# EAGLE design ham_ii_digital_interface (EAGLE 8.1.1)

## Sheet 1 of 4: Pin Headers
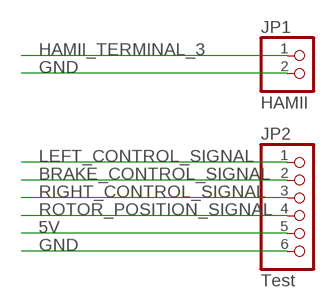
[diagram p0: schematic, sheet 1]

### Parts
JP1  HAMII  PINHD-1X2  [1X02]
JP2  Test  PINHD-1X6  [1X06]

### Nets
5V: JP2.5 ; also sheet 2,3,4
BRAKE_CONTROL_SIGNAL: JP2.2 ; also sheet 2,3
GND: JP1.2 JP2.6 ; also sheet 2,3,4
HAMII_TERMINAL_3: JP1.1 ; also sheet 4
LEFT_CONTROL_SIGNAL: JP2.1 ; also sheet 2,3
RIGHT_CONTROL_SIGNAL: JP2.3 ; also sheet 2,3
ROTOR_POSITION_SIGNAL: JP2.4 ; also sheet 2,4

## Sheet 2 of 4: Aruino Nano Interface
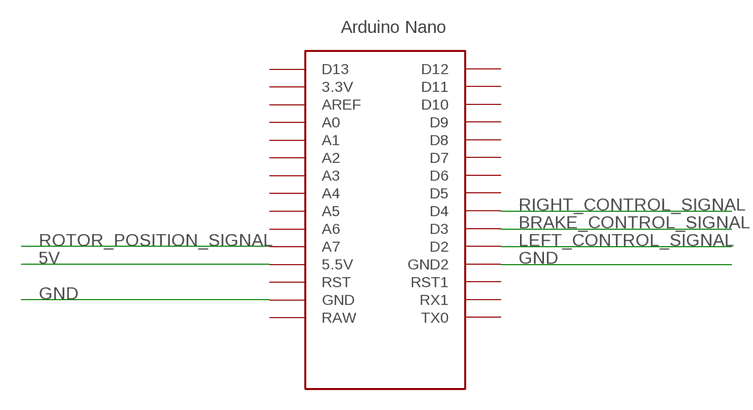
[diagram p1: schematic, sheet 2]

### Parts
U$1  NANO  [NANO]

### Nets
5V: U$1.5V(5.5V) ; also sheet 1,3,4
BRAKE_CONTROL_SIGNAL: U$1.D3 ; also sheet 1,3
GND: U$1.GND U$1.GND1(GND2) ; also sheet 1,3,4
LEFT_CONTROL_SIGNAL: U$1.D2 ; also sheet 1,3
RIGHT_CONTROL_SIGNAL: U$1.D4 ; also sheet 1,3
ROTOR_POSITION_SIGNAL: U$1.A7 ; also sheet 1,4
Unconnected: U$1.3.3V U$1.A0 U$1.A1 U$1.A2 U$1.A3 U$1.A4 U$1.A5 U$1.A6 U$1.AREF U$1.D5 U$1.D6 U$1.D7 U$1.D8 U$1.D9 U$1.D10 U$1.D11 U$1.D12 U$1.D13 U$1.ICSP1 U$1.ICSP2 U$1.ICSP3 U$1.ICSP4 U$1.ICSP5 U$1.ICSP6 U$1.RAW U$1.RST U$1.RST1 U$1.RX1 U$1.TX0

## Sheet 3 of 4: Relays
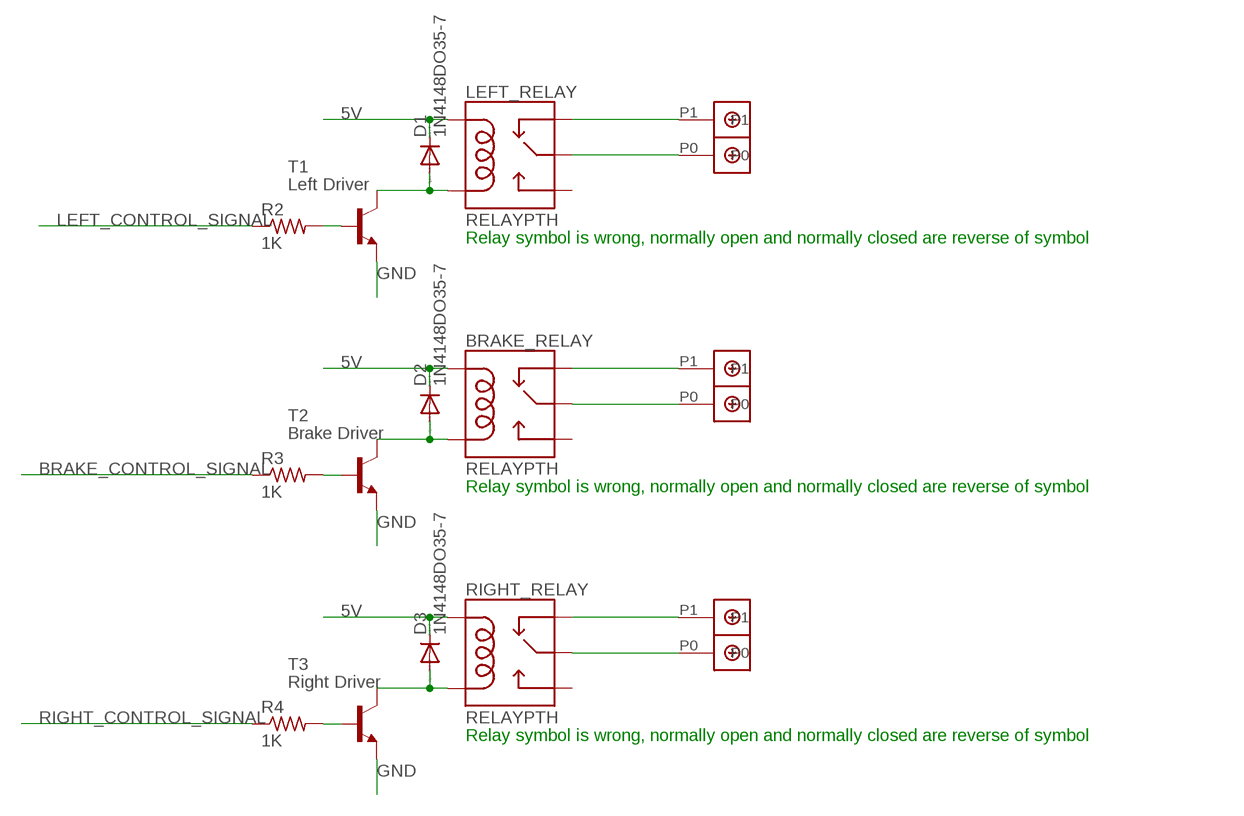
[diagram p2: schematic, sheet 3]

### Parts
BRAKE_RELAY  RELAYPTH  [SRD-05VDC-SL-C]
D1  1N4148DO35-7  [DO35-7]
D2  1N4148DO35-7  [DO35-7]
D3  1N4148DO35-7  [DO35-7]
LEFT_RELAY  RELAYPTH  [SRD-05VDC-SL-C]
R2  1K  R-US_0207/10  [0207/10]
R3  1K  R-US_0207/10  [0207/10]
R4  1K  R-US_0207/10  [0207/10]
RIGHT_RELAY  RELAYPTH  [SRD-05VDC-SL-C]
T1  Left Driver  -NPN-TO92  [TO92]
T2  Brake Driver  -NPN-TO92  [TO92]
T3  Right Driver  -NPN-TO92  [TO92]
U$5  DBCONN-1X2  [DBCONN-1X2]
U$6  DBCONN-1X2  [DBCONN-1X2]
U$7  DBCONN-1X2  [DBCONN-1X2]

### Nets
5V: BRAKE_RELAY.COIL1 D1.C D2.C D3.C LEFT_RELAY.COIL1 RIGHT_RELAY.COIL1 ; also sheet 1,2,4
BRAKE_CONTROL_SIGNAL: R3.1 ; also sheet 1,2
GND: T1.1(E) T2.1(E) T3.1(E) ; also sheet 1,2,4
LEFT_CONTROL_SIGNAL: R2.1 ; also sheet 1,2
N$2: LEFT_RELAY.SWCOMMON U$5.P0
N$3: LEFT_RELAY.SWCLOSED(SWCLOSE) U$5.P1
N$4: BRAKE_RELAY.SWCOMMON U$6.P0
N$5: BRAKE_RELAY.SWCLOSED(SWCLOSE) U$6.P1
N$6: RIGHT_RELAY.SWCOMMON U$7.P0
N$7: RIGHT_RELAY.SWCLOSED(SWCLOSE) U$7.P1
N$8: R2.2 T1.2(B)
N$9: R3.2 T2.2(B)
N$10: R4.2 T3.2(B)
N$11: D3.A RIGHT_RELAY.COIL0 T3.3(C)
N$12: BRAKE_RELAY.COIL0 D2.A T2.3(C)
N$13: D1.A LEFT_RELAY.COIL0 T1.3(C)
RIGHT_CONTROL_SIGNAL: R4.1 ; also sheet 1,2
Unconnected: BRAKE_RELAY.SWOPEN LEFT_RELAY.SWOPEN RIGHT_RELAY.SWOPEN

### Notes on the sheet
- Relay symbol is wrong, normally open and normally closed are reverse of symbol
- Relay symbol is wrong, normally open and normally closed are reverse of symbol
- Relay symbol is wrong, normally open and normally closed are reverse of symbol

## Sheet 4 of 4: Position Signal Buffer
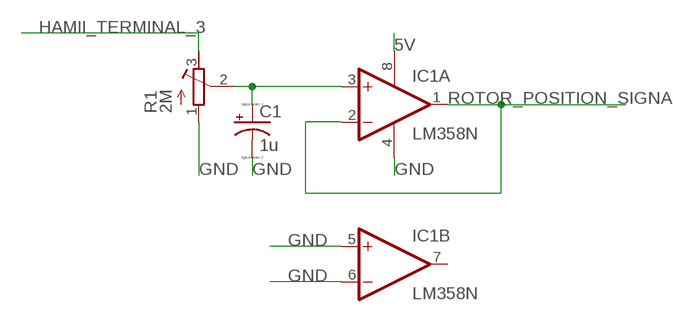
[diagram p3: schematic, sheet 4]

### Parts
C1  1u  CPOL-USE2-5  [E2-5]
IC1  LM358N  [DIL08]
R1  2M  R-TRIMM3296W  [RTRIM3296W]

### Nets
5V: IC1.8(P:V+) ; also sheet 1,2,3
GND: C1.- IC1.4(P:V-) IC1.5(B:+IN) IC1.6(B:-IN) R1.1(A) ; also sheet 1,2,3
HAMII_TERMINAL_3: R1.3(E) ; also sheet 1
N$1: C1.+ IC1.3(A:+IN) R1.2(S)
ROTOR_POSITION_SIGNAL: IC1.1(A:OUT) IC1.2(A:-IN) ; also sheet 1,2
Unconnected: IC1.7(B:OUT)

## Library data of the parts
BRAKE_RELAY LEFT_RELAY RIGHT_RELAY = SRD-05VDC-SL-C:RELAY: SPDT relay (COM-00101)
C1 = resistor:CPOL-US: POLARIZED CAPACITOR, American symbol
D1-D3 = diode:1N4148: DIODE high speed (Philips)
IC1 = linear:LM358: OP AMP also LM158; LM258; LM2904 Source: http://cache.national.com/ds/LM/LM158.pdf
JP1 = pinhead:PINHD-1X2: PIN HEADER
JP2 = pinhead:PINHD-1X6: PIN HEADER
R1 = resistor:R-TRIMM: Trimm resistor
R2-R4 = resistor:R-US_: RESISTOR, American symbol
T1-T3 = transistor:*-NPN-: NPN Transistror BF959 corrected 2008.03.06
U$1 = Arduino-clone:NANO: Arduino Nano
U$5-U$7 = Terminal Block Connector:DBCONN-1X2

## Board
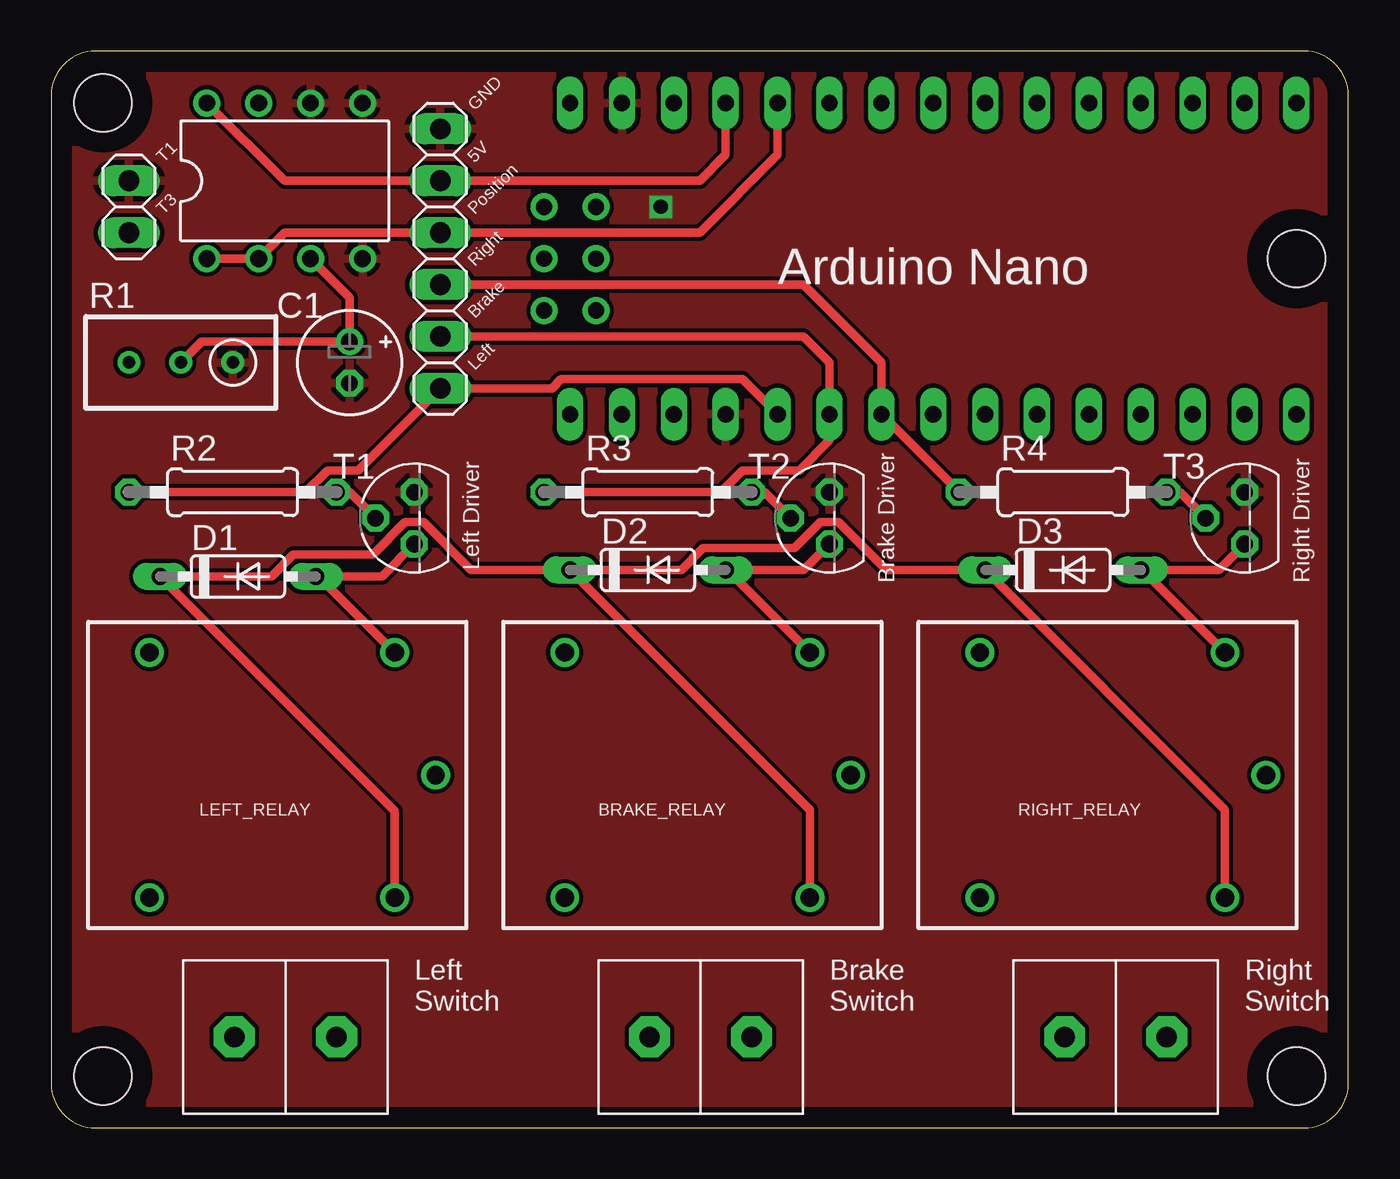
[diagram p4: board, top side]
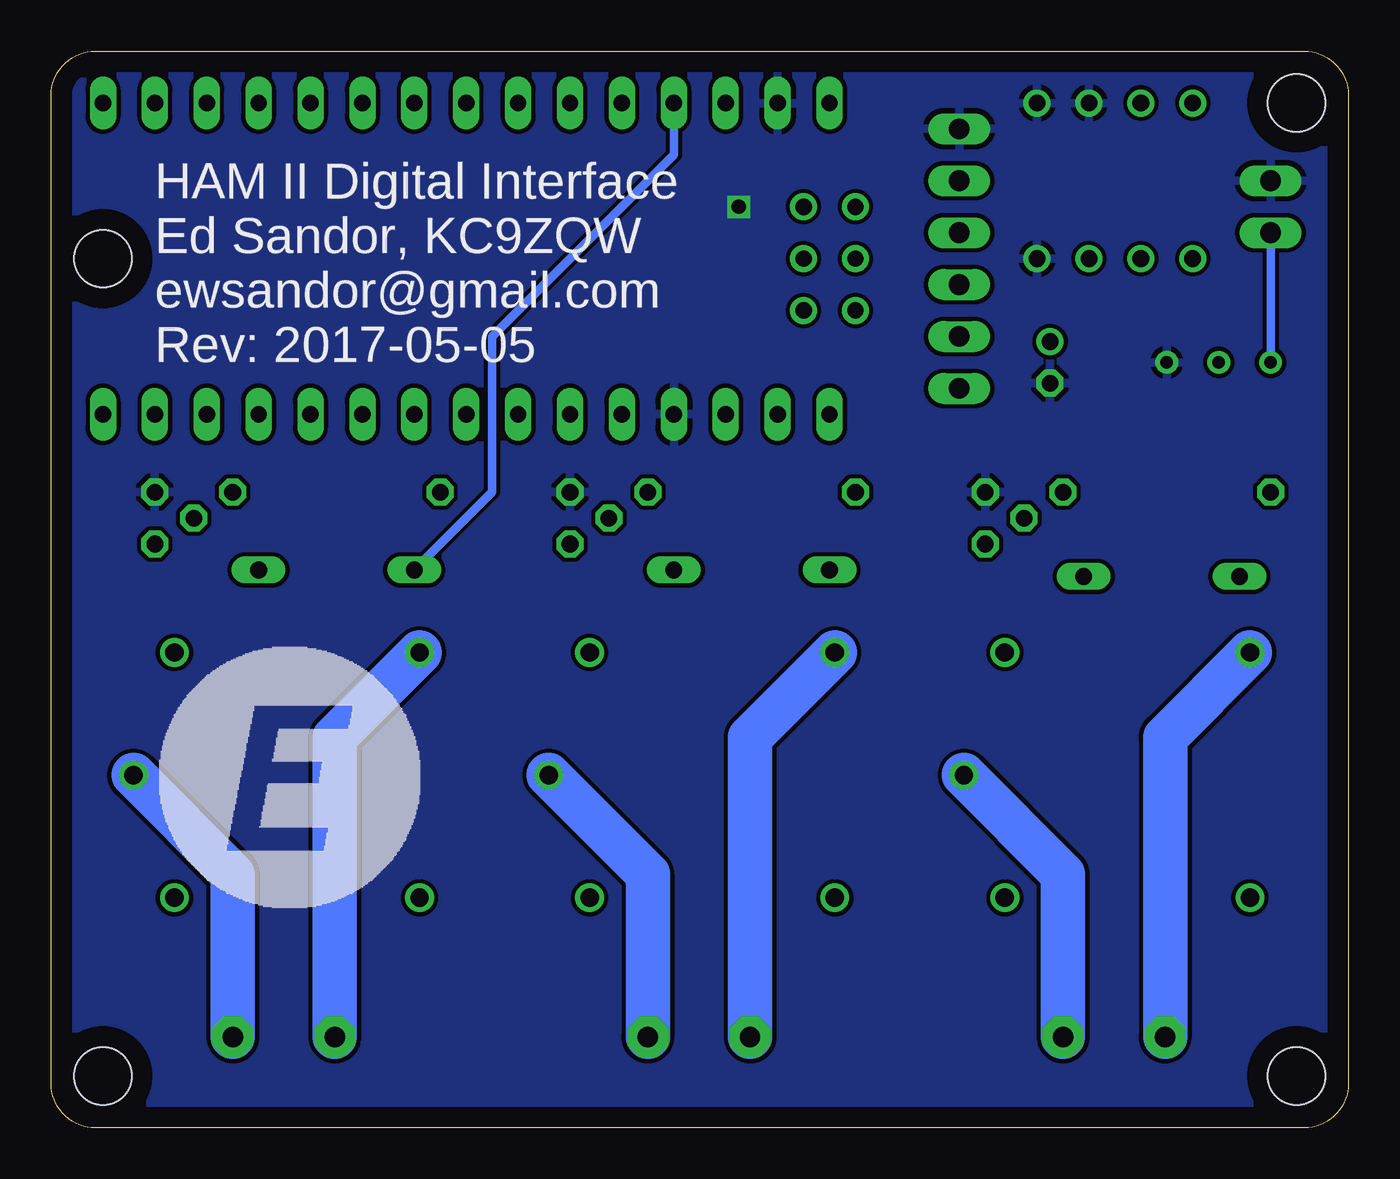
[diagram p5: board, bottom side, seen from below]

Size 63.5 x 52.7 mm. Coordinates in mm from the lower left corner, seen from the top.
Outline: 0,50.54 0,2.17 arc90 2.17,0 61.33,0 arc90 63.5,2.17 63.5,50.54 arc90 61.33,52.7 2.17,52.7 arc90 0,50.54
Copper layers (1*16): Top 0.035mm / dielectric 1.5mm / Bottom 0.035mm
Design rules "default *": minimum track width 10mil, minimum drill 24mil, track to track 8mil, track to pad 8mil, pad to pad 8mil, via to via 8mil, smd to smd 8mil, copper to edge 40mil, drill to drill 8mil, minimum pad ring 10mil, minimum via ring 8mil, stop-mask expansion 4mil, vias tented up to drill 0mil, thermal gap 10mil
Holes 2.8 mm at 2.54,50.16 2.54,2.54 60.96,42.55 60.96,2.54

### Footprints (pad centres in the part's own frame; a part is rotated, then mirrored left to right if it is on the bottom)
SRD-05VDC-SL-C = drill 0.9: COIL0 -5.39,-6.12; COIL1 -5.39,5.88; SWCLOSED 6.61,-6.12; SWCOMMON -7.39,-0.12; SWOPEN 6.61,5.88
E2-5 = drill 0.813 pad 1.27: + -1.016,0 | drill 0.813 pad 1.27 octagon: - 1.016,0
DO35-7 = drill 0.813 long: A 3.81,0; C -3.81,0
DIL08 = drill 0.813 pad 1.27: 1 -3.81,-3.81; 2 -1.27,-3.81; 3 1.27,-3.81; 4 3.81,-3.81; 5 3.81,3.81; 6 1.27,3.81; 7 -1.27,3.81; 8 -3.81,3.81
1X02 = drill 1.016 long: 1 -1.27,0; 2 1.27,0
1X06 = drill 1.016 long: 1 -6.35,0; 2 -3.81,0; 3 -1.27,0; 4 1.27,0; 5 3.81,0; 6 6.35,0
RTRIM3296W = drill 0.61: 1 0,-2.54; 2 0,0; 3 0,2.54
0207/10 = drill 0.813 octagon: 1 -5.08,0; 2 5.08,0
TO92 = drill 0.813 octagon: 1 1.27,0; 2 0,1.905; 3 -1.27,0
NANO = drill 0.8 long: 3.3V -10.16,24.13; 5V -10.16,-1.27; A0 -10.16,19.05; A1 -10.16,16.51; A2 -10.16,13.97; A3 -10.16,11.43; A4 -10.16,8.89; A5 -10.16,6.35; A6 -10.16,3.81; A7 -10.16,1.27; AREF -10.16,21.59; D2 5.08,1.27; D3 5.08,3.81; D4 5.08,6.35; D5 5.08,8.89; D6 5.08,11.43; D7 5.08,13.97; D8 5.08,16.51; D9 5.08,19.05; D10 5.08,21.59; D11 5.08,24.13; D12 5.08,26.67; D13 -10.16,26.67; GND -10.16,-6.35; GND1 5.08,-1.27; RAW -10.16,-8.89; RST -10.16,-3.81; RST1 5.08,-3.81; RX1 5.08,-6.35; TX0 5.08,-8.89 | drill 0.8: ICSP1 -5.08,-10.16; ICSP2 -5.08,-7.62; ICSP3 -2.54,-10.16; ICSP4 -2.54,-7.62; ICSP5 0,-10.16; ICSP6 0,-7.62
DBCONN-1X2 = drill 1 pad 2 octagon: P0 -2.54,0; P1 2.46,0

### Placement (x,y rotation side)
BRAKE_RELAY  31.75,17.14 180 top
C1  14.61,37.47 270 top
D1  9.14,26.99 0 top
D2  29.21,27.3 0 top
D3  49.53,27.3 0 top
IC1  11.43,46.35 0 top
JP1  3.81,45.09 90 top
JP2  19.05,42.55 90 top
LEFT_RELAY  11.43,17.14 180 top
R1  6.35,37.47 90 top
R2  8.89,31.11 0 top
R3  29.21,31.11 0 top
R4  49.53,31.11 0 top
RIGHT_RELAY  52.07,17.14 180 top
T1  17.78,29.84 90 top
T2  38.1,29.84 90 top
T3  58.42,29.84 90 top
U$1  34.29,40.01 270 top
U$5  11.43,4.45 180 top
U$6  31.75,4.45 180 top
U$7  52.07,4.45 180 top

### Tracks (layer width: path | path; a pad name or v marks a point on that pad's centre or on a via)
5V
  Top 0.406: D2.C 37.14,15.56 BRAKE_RELAY.COIL1 | RIGHT_RELAY.COIL1 57.46,15.56 D3.C 40.88,27.3 38.54,29.64 37.66,29.64 36.39,28.37 31.92,28.37 30.85,27.3 D2.C | IC1.8 11.43,46.35 JP2.5 31.75,46.35 33.02,47.62 U$1.5V | D2.C 20.56,27.3 18.22,29.64 17.34,29.64 15.75,28.05 11.85,28.05 10.79,26.99 D1.C 16.82,15.5 LEFT_RELAY.COIL1
  Bottom 0.406: U$1.5V 33.02,47.62 41.91,38.73 41.91,31.11 D3.C
BRAKE_CONTROL_SIGNAL
  Top 0.406: JP2.2 36.83,38.73 38.1,37.47 U$1.D3 38.1,33.66 36.63,32.18 33.85,32.18 32.78,31.11 R3.1
GND  (via drill 0.7)
  other vias: 29.84,45.09
  pour Bottom: -1.27,-3.81 64.77,-3.81 64.77,55.24 -1.27,55.24
  pour Top: -2.54,55.24 64.77,55.24 64.77,-3.81 -2.54,-3.81
HAMII_TERMINAL_3
  Bottom 0.406: JP1.1 R1.3
LEFT_CONTROL_SIGNAL
  Top 0.406: U$1.D2 33.85,36.64 24.96,36.64 24.52,36.2 JP2.1 15.04,32.18 13.53,32.18 12.46,31.11 R2.1
N$1
  Top 0.406: IC1.3 14.61,40.64 C1.+ 7.37,38.48 R1.2
N$2
  Bottom 2.184: LEFT_RELAY.SWCOMMON 13.97,12.41 U$5.P0
N$3
  Bottom 2.184: LEFT_RELAY.SWCLOSED 8.97,19.11 U$5.P1
N$4
  Bottom 2.184: BRAKE_RELAY.SWCOMMON 34.29,12.41 U$6.P0
N$5
  Bottom 2.184: BRAKE_RELAY.SWCLOSED 29.29,19.11 U$6.P1
N$6
  Bottom 2.184: RIGHT_RELAY.SWCOMMON 54.61,12.41 U$7.P0
N$7
  Bottom 2.184: RIGHT_RELAY.SWCLOSED 49.61,19.11 U$7.P1
N$8
  Top 0.406: T1.2 14.61,31.11 R2.2
N$9
  Top 0.406: T2.2 34.92,31.11 R3.2
N$10
  Top 0.406: T3.2 55.24,31.11 R4.2
N$11
  Top 0.406: RIGHT_RELAY.COIL0 53.42,27.3 D3.A 57.15,27.3 T3.3
N$12
  Top 0.406: BRAKE_RELAY.COIL0 33.1,27.3 D2.A 36.83,27.3 T2.3
N$13
  Top 0.406: T1.3 16.19,26.99 D1.A 13.1,26.99 LEFT_RELAY.COIL0
RIGHT_CONTROL_SIGNAL
  Top 0.406: R4.1 U$1.D4 40.64,37.47 36.83,41.27 JP2.3
ROTOR_POSITION_SIGNAL
  Top 0.406: IC1.1 IC1.2 11.43,43.81 JP2.4 31.75,43.81 35.56,47.62 U$1.A7

### Text on the board
tPlace: GND | T1 | 5V | T3 | Position | Right | Arduino Nano | Brake | Left | Left / Switch | Brake / Switch | Right / Switch
bPlace: HAM II Digital Interface / Ed Sandor, KC9ZQW / ewsandor@gmail.com / Rev: 2017-05-05